# Altium schematic sheet STM32F302VBT_simple.SchDoc
size A4
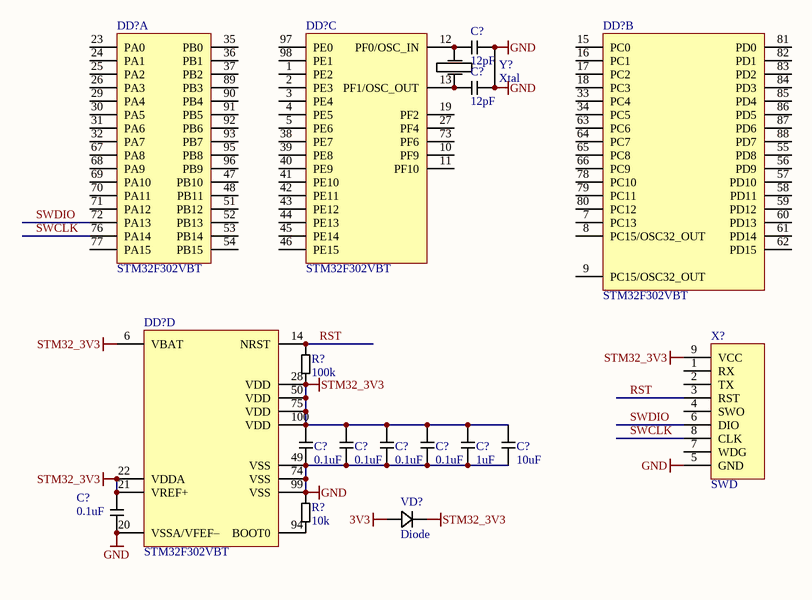
[diagram p0: STM32F302VBT_simple.SchDoc]

## Parts
(Parts that share a designator on the sheet are numbered #1, #2 ... from top to bottom, then left to right.)
C?#1  12pF  [C0603]
C?#2  12pF  [C0603]
C?#3  0.1uF  [C0603]
C?#4  0.1uF  [C0603]
C?#5  0.1uF  [C0603]
C?#6  0.1uF  [C0603]
C?#7  1uF  [C0603]
C?#8  10uF  [C0603]
C?#9  0.1uF  [C0603]
DD?#1  STM32F302VBT  [LQFP-100]  (part A of 4)
DD?#2  STM32F302VBT  [LQFP-100]  (part C of 4)
DD?#3  STM32F302VBT  [LQFP-100]  (part B of 4)
DD?#4  STM32F302VBT  [LQFP-100]  (part D of 4)
R?#1  100k  [R0603]
R?#2  10k  [R0603]
VD?  Diode  [SOD-323]
X?  SWD  [PogoSWD]
Y?  Xtal  [Xtal 0532]

## Nets
3V3: VD?.1(K)
GND: C?#1.2 C?#2.2 C?#3.2 C?#4.2 C?#5.2 C?#6.2 C?#7.2 C?#8.2 C?#9.2 DD?#4.20(VSSA/VFEF–) DD?#4.49(VSS) DD?#4.74(VSS) DD?#4.99(VSS) R?#2.2 X?.5(GND) Y?.1(GND) Y?.3(GND)
STM32_3V3: C?#3.1 C?#4.1 C?#5.1 C?#6.1 C?#7.1 C?#8.1 C?#9.1 DD?#4.6(VBAT) DD?#4.21(VREF+) DD?#4.22(VDDA) DD?#4.28(VDD) DD?#4.50(VDD) DD?#4.75(VDD) DD?#4.100(VDD) R?#1.1 VD?.2(A) X?.9(VCC)
RST: DD?#4.14(NRST) R?#1.2 X?.3(RST)
SWCLK: DD?#1.76(PA14) X?.8(CLK)
SWDIO: DD?#1.72(PA13) X?.6(DIO)
NetC?#1_1: C?#1.1 DD?#2.12(PF0/OSC_IN) Y?.4(X2)
NetC?#2_1: C?#2.1 DD?#2.13(PF1/OSC_OUT) Y?.2(X1)
NetDD?#4_94: DD?#4.94(BOOT0) R?#2.1

Not connected (* = marked no-connect by the designer): DD?#1 23(PA0) 24(PA1) 25(PA2) 26(PA3) 29(PA4) 30(PA5) 31(PA6) 32(PA7) 35(PB0) 36(PB1) 37(PB2) 47(PB10) 48(PB11) 51(PB12) 52(PB13) 53(PB14) 54(PB15) 67(PA8) 68(PA9) 69(PA10) 70(PA11) 71(PA12) 77(PA15) 89(PB3) 90(PB4) 91(PB5) 92(PB6) 93(PB7) 95(PB8) 96(PB9); DD?#2 1(PE2) 2(PE3) 3(PE4) 4(PE5) 5(PE6) 10(PF9) 11(PF10) 19(PF2) 27(PF4) 38(PE7) 39(PE8) 40(PE9) 41(PE10) 42(PE11) 43(PE12) 44(PE13) 45(PE14) 46(PE15) 73(PF6) 97(PE0) 98(PE1); DD?#3 7(PC13) 8(PC15/OSC32_OUT) 9(PC15/OSC32_OUT) 15(PC0) 16(PC1) 17(PC2) 18(PC3) 33(PC4) 34(PC5) 55(PD8) 56(PD9) 57(PD10) 58(PD11) 59(PD12) 60(PD13) 61(PD14) 62(PD15) 63(PC6) 64(PC7) 65(PC8) 66(PC9) 78(PC10) 79(PC11) 80(PC12) 81(PD0) 82(PD1) 83(PD2) 84(PD3) 85(PD4) 86(PD5) 87(PD6) 88(PD7); X? 1(RX) 2(TX) 4(SWO) 7(WDG)

## Library data of the parts
C?#1-C?#9 = C: Capacitor
DD?#1-DD?#4 = STM32F302VBT: ST Cortex-M4F MCU LQFP-100
R?#1 R?#2 = R: Resistor
VD? = Diode: SMD diode
X? = SWD-Pogo: SWD connector for PogoPins
Y? = Xtal: Quartz crystal